# EAGLE design boardV5 (EAGLE 6.4)
Smart Watch

## Sheet 1 of 4: Main CPU
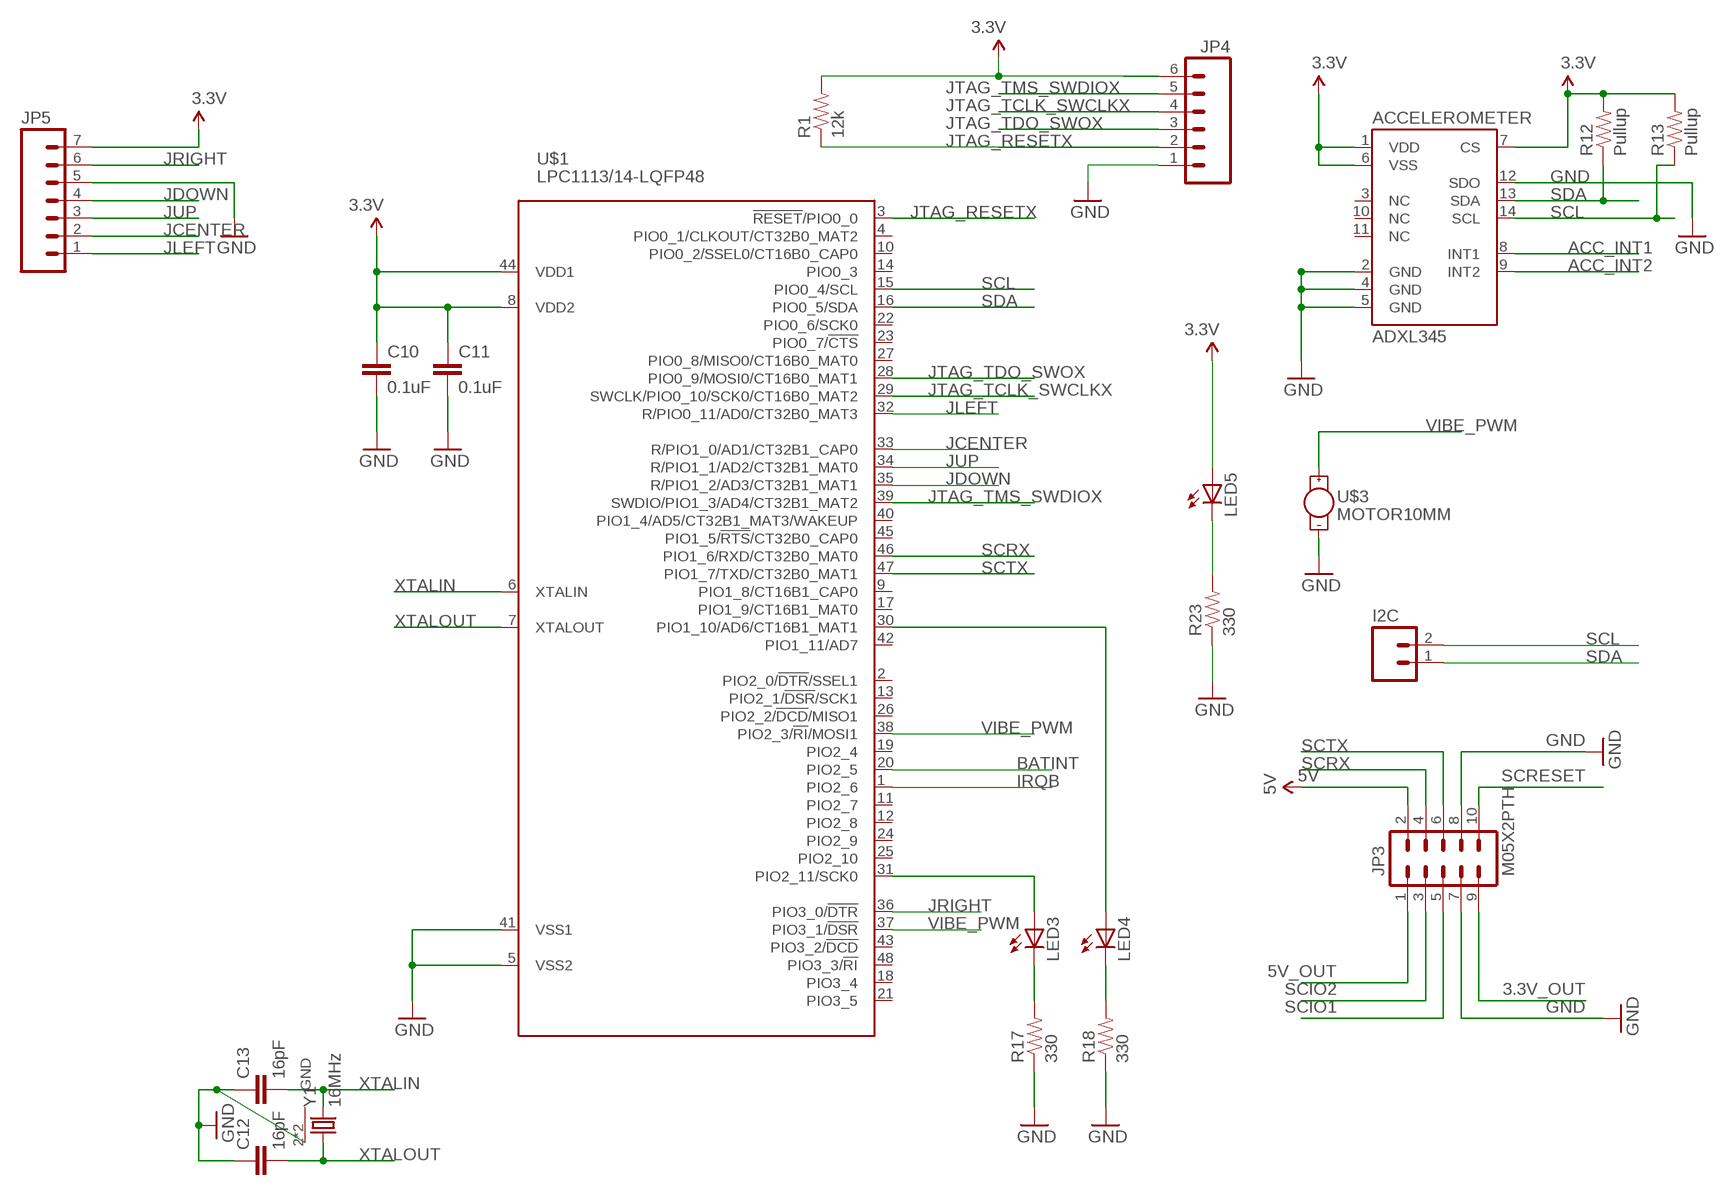
[diagram p0: schematic, sheet 1]

### Parts
ACCELEROMETER  ADXL345  [LGA14]
C10  0.1uF  CAP0603-CAP  [0603-CAP]
C11  0.1uF  CAP0603-CAP  [0603-CAP]
C12  16pF  CAP0603-CAP  [0603-CAP]
C13  16pF  CAP0603-CAP  [0603-CAP]
I2C  M02POLAR  [MOLEX-1X2]
JP3  M05X2PTH  [AVR_ICSP]
JP4  M06POLAR  [MOLEX-1X6]
JP5  M07  [1X07]
LED3  LED0603  [LED-0603]
LED4  LED0603  [LED-0603]
LED5  LED0603  [LED-0603]
R1  12k  RESISTOR0603-RES  [0603-RES]
R12  Pullup  RESISTOR0603-RES  [0603-RES]
R13  Pullup  RESISTOR0603-RES  [0603-RES]
R17  330  RESISTOR0603-RES  [0603-RES]
R18  330  RESISTOR0603-RES  [0603-RES]
R23  330  RESISTOR0603-RES  [0603-RES]
U$1  LPC1113/14-LQFP48  [LQFP48]
U$3  MOTOR10MM  [VIBE-MOTOR-10MM]
Y1  16MHz  CRYSTAL5X3  [CRYSTAL-SMD-5X3]

### Nets
3.3V: ACCELEROMETER.1(VDD) ACCELEROMETER.6(VSS) ACCELEROMETER.7(CS) C10.1 C11.1 JP4.6 JP5.7 LED5.A R1.2 R12.2 R13.2 U$1.8(VDD2) U$1.44(VDD1) ; also sheet 3,4
3.3V_OUT: JP3.9
5V: JP3.2 ; also sheet 4
5V_OUT: JP3.1
ACC_INT1: ACCELEROMETER.8(INT1)
ACC_INT2: ACCELEROMETER.9(INT2)
BATINT: U$1.20(PIO2_5) ; also sheet 4
GND: ACCELEROMETER.2(GND) ACCELEROMETER.4(GND) ACCELEROMETER.5(GND) ACCELEROMETER.12(SDO) C10.2 C11.2 C12.1 C13.1 JP3.7 JP3.8 JP4.1 JP5.5 R17.1 R18.1 R23.1 U$1.5(VSS2) U$1.41(VSS1) U$3.- Y1.2(GND) Y1.4(GND) ; also sheet 3,4
IRQB: U$1.1(PIO2_6) ; also sheet 3
JCENTER: JP5.2 U$1.33(R/PIO1_0/AD1/CT32B1_CAP0)
JDOWN: JP5.4 U$1.35(R/PIO1_2/AD3/CT32B1_MAT1)
JLEFT: JP5.1 U$1.32(R/PIO0_11/AD0/CT32B0_MAT3)
JRIGHT: JP5.6 U$1.36(PIO3_0/!DTR!)
JTAG_RESETX: JP4.2 R1.1 U$1.3(!RESET!/PIO0_0)
JTAG_TCLK_SWCLKX: JP4.4 U$1.29(SWCLK/PIO0_10/SCK0/CT16B0_MAT2)
JTAG_TDO_SWOX: JP4.3 U$1.28(PIO0_9/MOSI0/CT16B0_MAT1)
JTAG_TMS_SWDIOX: JP4.5 U$1.39(SWDIO/PIO1_3/AD4/CT32B1_MAT2)
JUP: JP5.3 U$1.34(R/PIO1_1/AD2/CT32B1_MAT0)
N$15: LED3.A U$1.31(PIO2_11/SCK0)
N$16: LED4.A U$1.30(PIO1_10/AD6/CT16B1_MAT1)
N$17: LED3.C R17.2
N$18: LED4.C R18.2
N$21: LED5.C R23.2
SCIO1: JP3.5
SCIO2: JP3.3
SCL: ACCELEROMETER.14(SCL) I2C.2 R13.1 U$1.15(PIO0_4/SCL) ; also sheet 3,4
SCRESET: JP3.10
SCRX: JP3.4 U$1.46(PIO1_6/RXD/CT32B0_MAT0)
SCTX: JP3.6 U$1.47(PIO1_7/TXD/CT32B0_MAT1)
SDA: ACCELEROMETER.13(SDA) I2C.1 R12.1 U$1.16(PIO0_5/SDA) ; also sheet 3,4
VIBE_PWM: U$1.37(PIO3_1/!DSR!) U$1.38(PIO2_3/!RI!/MOSI1) U$3.+
XTALIN: C13.2 U$1.6(XTALIN) Y1.3
XTALOUT: C12.2 U$1.7(XTALOUT) Y1.1
Unconnected: ACCELEROMETER.3(NC) ACCELEROMETER.10(NC) ACCELEROMETER.11(NC) U$1.2(PIO2_0/!DTR!/SSEL1) U$1.4(PIO0_1/CLKOUT/CT32B0_MAT2) U$1.9(PIO1_8/CT16B1_CAP0) U$1.10(PIO0_2/SSEL0/CT16B0_CAP0) U$1.11(PIO2_7) U$1.12(PIO2_8) U$1.13(PIO2_1/!DSR!/SCK1) U$1.14(PIO0_3) U$1.17(PIO1_9/CT16B1_MAT0) U$1.18(PIO3_4) U$1.19(PIO2_4) U$1.21(PIO3_5) U$1.22(PIO0_6/SCK0) U$1.23(PIO0_7/!CTS!) U$1.24(PIO2_9) U$1.25(PIO2_10) U$1.26(PIO2_2/!DCD!/MISO1) U$1.27(PIO0_8/MISO0/CT16B0_MAT0) U$1.40(PIO1_4/AD5/CT32B1_MAT3/WAKEUP) U$1.42(PIO1_11/AD7) U$1.43(PIO3_2/!DCD!) U$1.45(PIO1_5/!RTS!/CT32B0_CAP0) U$1.48(PIO3_3/!RI!)

## Sheet 2 of 4: Joystick

## Sheet 3 of 4: Bluetooth
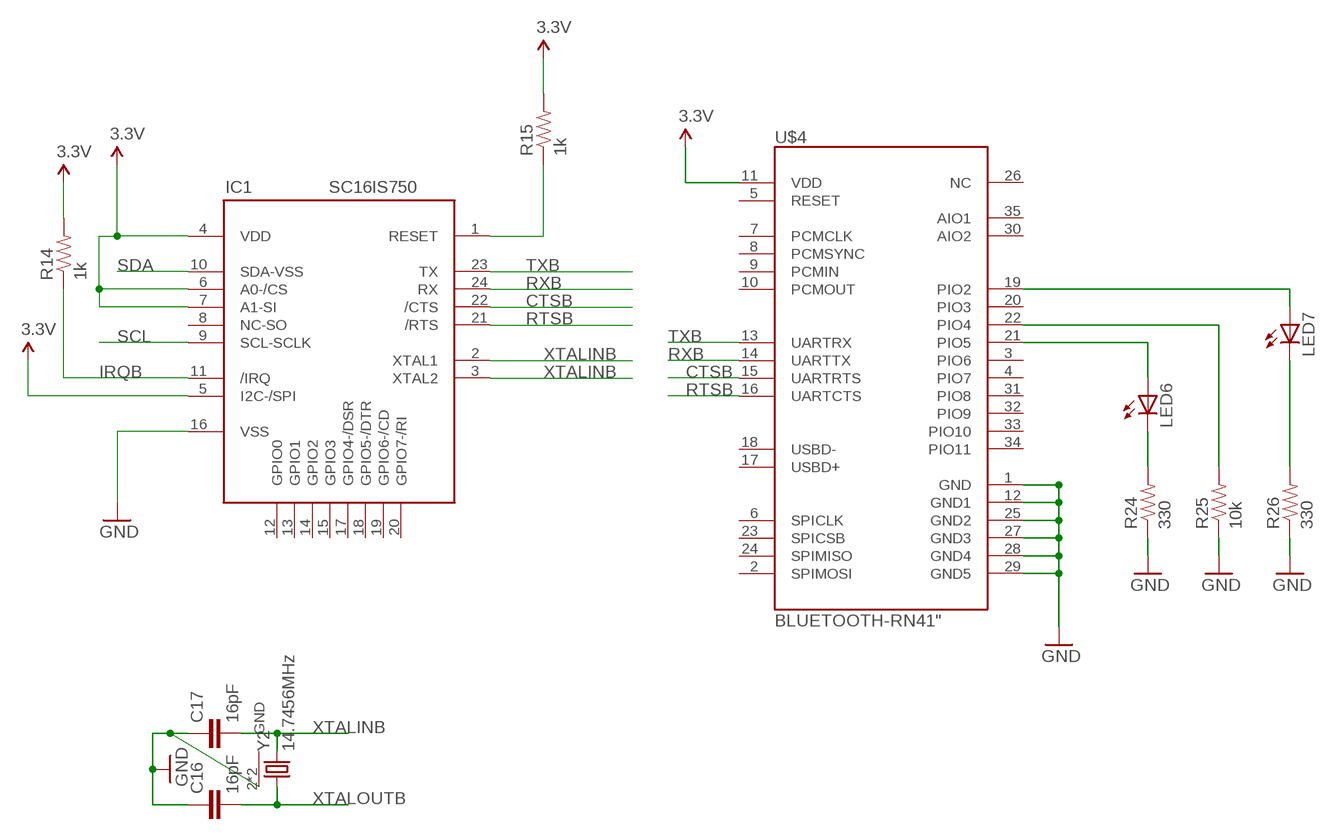
[diagram p1: schematic, sheet 3]

### Parts
C16  16pF  CAP0603-CAP  [0603-CAP]
C17  16pF  CAP0603-CAP  [0603-CAP]
IC1  SC16IS750  [QFN-24]
LED6  LED0603  [LED-0603]
LED7  LED0603  [LED-0603]
R14  1k  RESISTOR0603-RES  [0603-RES]
R15  1k  RESISTOR0603-RES  [0603-RES]
R24  330  RESISTOR0603-RES  [0603-RES]
R25  10k  RESISTOR0603-RES  [0603-RES]
R26  330  RESISTOR0603-RES  [0603-RES]
U$4  BLUETOOTH-RN41"  [RN41]
Y2  14.7456MHz  CRYSTAL5X3  [CRYSTAL-SMD-5X3]

### Nets
3.3V: IC1.4(VDD) IC1.5(I2C-/SPI) IC1.6(A0-/CS) IC1.7(A1-SI) R14.2 R15.2 U$4.11(VDD) ; also sheet 1,4
CTSB: IC1.22(/CTS) U$4.15(UARTRTS)
GND: C16.1 C17.1 IC1.16(VSS) R24.1 R25.1 R26.1 U$4.1(GND) U$4.12(GND1) U$4.25(GND2) U$4.27(GND3) U$4.28(GND4) U$4.29(GND5) Y2.2(GND) Y2.4(GND) ; also sheet 1,4
IRQB: IC1.11(/IRQ) R14.1 ; also sheet 1
N$11: IC1.1(RESET) R15.1
N$20: LED7.A U$4.19(PIO2)
N$22: R25.2 U$4.22(PIO4)
N$23: LED6.A U$4.21(PIO5)
N$24: LED6.C R24.2
N$25: LED7.C R26.2
RTSB: IC1.21(/RTS) U$4.16(UARTCTS)
RXB: IC1.24(RX) U$4.14(UARTTX)
SCL: IC1.9(SCL-SCLK) ; also sheet 1,4
SDA: IC1.10(SDA-VSS) ; also sheet 1,4
TXB: IC1.23(TX) U$4.13(UARTRX)
XTALINB: C17.2 IC1.2(XTAL1) Y2.3
XTALOUTB: C16.2 IC1.3(XTAL2) Y2.1
Unconnected: IC1.8(NC-SO) IC1.12(GPIO0) IC1.13(GPIO1) IC1.14(GPIO2) IC1.15(GPIO3) IC1.17(GPIO4-/DSR) IC1.18(GPIO5-/DTR) IC1.19(GPIO6-/CD) IC1.20(GPIO7-/RI) U$4.2(SPIMOSI) U$4.3(PIO6) U$4.4(PIO7) U$4.5(RESET) U$4.6(SPICLK) U$4.7(PCMCLK) U$4.8(PCMSYNC) U$4.9(PCMIN) U$4.10(PCMOUT) U$4.17(USBD+) U$4.18(USBD-) U$4.20(PIO3) U$4.23(SPICSB) U$4.24(SPIMISO) U$4.26(NC) U$4.30(AIO2) U$4.31(PIO8) U$4.32(PIO9) U$4.33(PIO10) U$4.34(PIO11) U$4.35(AIO1)

## Sheet 4 of 4: Power
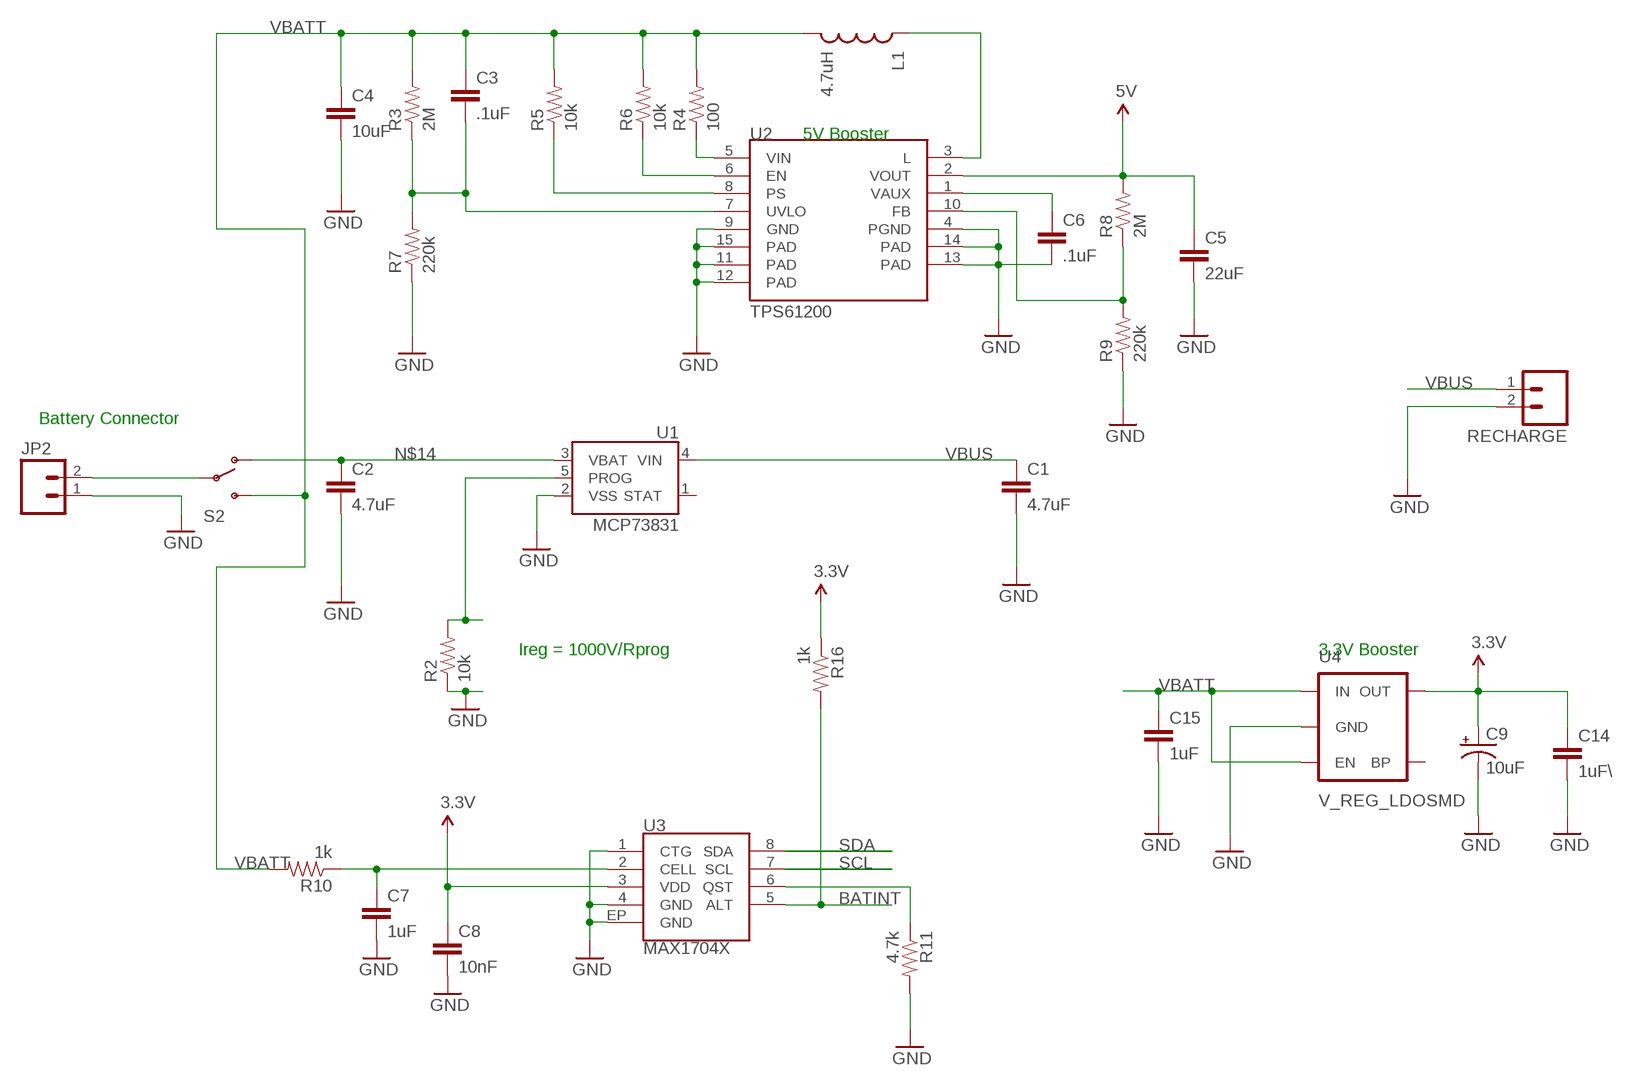
[diagram p2: schematic, sheet 4]

### Parts
C1  4.7uF  CAP0603-CAP  [0603-CAP]
C2  4.7uF  CAP0603-CAP  [0603-CAP]
C3  .1uF  CAP0603-CAP  [0603-CAP]
C4  10uF  CAP0603-CAP  [0603-CAP]
C5  22uF  CAP0603-CAP  [0603-CAP]
C6  .1uF  CAP0603-CAP  [0603-CAP]
C7  1uF  CAP0603-CAP  [0603-CAP]
C8  10nF  CAP0603-CAP  [0603-CAP]
C9  10uF  10UF-TANT  [EIA3216]
C14  1uF\  CAP0603-CAP  [0603-CAP]
C15  1uF  CAP0603-CAP  [0603-CAP]
JP2  M02PTH  [1X02]
L1  4.7uH  INDUCTOR.  [CDRH2D09]
R2  10k  RESISTOR0603-RES  [0603-RES]
R3  2M  RESISTOR0603-RES  [0603-RES]
R4  100  RESISTOR0603-RES  [0603-RES]
R5  10k  RESISTOR0603-RES  [0603-RES]
R6  10k  RESISTOR0603-RES  [0603-RES]
R7  220k  RESISTOR0603-RES  [0603-RES]
R8  2M  RESISTOR0603-RES  [0603-RES]
R9  220k  RESISTOR0603-RES  [0603-RES]
R10  1k  RESISTOR0603-RES  [0603-RES]
R11  4.7k  RESISTOR0603-RES  [0603-RES]
R16  1k  RESISTOR0603-RES  [0603-RES]
RECHARGE  M02POLAR  [MOLEX-1X2]
S2  SWITCH-SPDT-SMD-A  [SWITCH-SPST-SMD-A]
U1  MCP73831  [SOT23-5]
U2  TPS61200  [QFN-10_PAD]
U3  MAX1704X  [TDFN-8]
U4  V_REG_LDOSMD  [SOT23-5]

### Nets
3.3V: C8.1 C9.A(+) C14.1 R16.1 U3.3(VDD) U4.5(OUT) ; also sheet 1,3
5V: C5.1 R8.2 U2.2(VOUT) ; also sheet 1
BATINT: R16.2 U3.5(ALT) ; also sheet 1
GND: C1.2 C2.2 C4.2 C5.2 C6.2 C7.2 C8.2 C9.C(-) C14.2 C15.2 JP2.1 R2.1 R7.1 R9.1 R11.2 RECHARGE.2 U1.2(VSS) U2.4(PGND) U2.9(GND) U2.11(PAD) U2.12(PAD) U2.13(PAD) U2.14(PAD) U2.15(PAD) U3.1(CTG) U3.4(GND) U3.EP(GND) U4.2(GND) ; also sheet 1,3
N$2: R2.2 U1.5(PROG)
N$3: C3.2 R3.1 R7.2 U2.7(UVLO)
N$4: C6.1 U2.1(VAUX)
N$5: R6.1 U2.6(EN)
N$6: R5.1 U2.8(PS)
N$7: L1.P$1 U2.3(L)
N$8: R8.1 R9.2 U2.10(FB)
N$9: C7.1 R10.1 U3.2(CELL)
N$10: R11.1 U3.6(QST)
N$14: C2.1 S2.1(O) U1.3(VBAT)
N$26: JP2.2 S2.2(P)
SCL: U3.7(SCL) ; also sheet 1,3
SDA: U3.8(SDA) ; also sheet 1,3
VBATT: C3.1 C4.1 C15.1 L1.P$2 R3.2 R4.2 R5.2 R6.2 R10.2 S2.3(S) U4.1(IN) U4.3(EN)
VBUS: C1.1 RECHARGE.1 U1.4(VIN)
VIN: R4.1 U2.5(VIN)
Unconnected: U1.1(STAT) U4.4(BP)

### Notes on the sheet
- 5V Booster
- Battery Connector
- Ireg = 1000V/Rprog | 3.3V Booster

## Library data of the parts
ACCELEROMETER = SparkFun-Sensors:ADXL345: 3-axis SPI/I2C 2/4/8/16g accelerometer
C1-C8 C10-C17 = SparkFun-Passives:CAP: Capacitor Standard 0603 ceramic capacitor, and 0.1" leaded capacitor.
C9 = SparkFun-Capacitors:10UF-TANT: 10uF Tantalum SMT CAP-00811- 16V 10% (EIA-3216); PROD_ID: CAP-00811
I2C JP2 RECHARGE = SparkFun-Connectors:M02: Header 2 Standard 2-pin 0.1" header. Use with straight break away headers (SKU : PRT-00116), right angle break away headers (PRT-00553), swiss pins (PRT-00743), machine pins (PRT-00117), and female headers (PRT-00115). Molex polarized connector foot print use with SKU : PRT-08233 with associated crimp pins and housings.
IC1 = SparkFun-DigitalIC:SC16IS750: SPI/I2C/IrDA to UART
JP3 = SparkFun-Connectors:M05X2: Header 5x2 Standard 10-pin dual row 0.1" header. Commonly used with AVR-ISP. Use with Spark Fun Electronics SKU: PRT-00778
JP4 = SparkFun-Connectors:M06: Header 6 Standard 6-pin 0.1" header. Use with straight break away headers (SKU : PRT-00116), right angle break away headers (PRT-00553), swiss pins (PRT-00743), machine pins (PRT-00117), and female headers (PRT-00115). Molex polarized connector foot print use with SKU : PRT-08094 with associated crimp pins and housings. NOTES ON THE VARIANTS LOCK and LOCK_LONGPADS... This footprint was designed to help hold the alignment of a through-hole component (i.e. 6-pin header) while soldering it into place. You may notice that each hole has been shifted either up or down by 0.005 of an inch from it's more standard position (which is a perfectly straight line). This slight alteration caused the pins (the squares in the middle) to touch the edges of the holes. Because they are alternating, it causes a "brace" to hold the component in place. 0.005 has proven to be the perfect amount of "off-center" position when using our standard breakaway headers. Although looks a little odd when you look at the bare footprint, once you have a header in there, the alteration is very hard to notice. Also, if you push a header all the way into place, it is covered up entirely on the bottom side. This idea of altering the position of holes to aid alignment will be further integrated into the Sparkfun Library for other footprints. It can help hold any component with 3 or more connection pins.
JP5 = SparkFun-Connectors:M07: Header 7 Standard 7-pin 0.1" header. Use with straight break away headers (SKU : PRT-00116), right angle break away headers (PRT-00553), swiss pins (PRT-00743), machine pins (PRT-00117), and female headers (PRT-00115). NOTES ON THE VARIANTS LOCK and LOCK_LONGPADS... This footprint was designed to help hold the alignment of a through-hole component (i.e. 7-pin header) while soldering it into place. You may notice that each hole has been shifted either up or down by 0.005 of an inch from it's more standard position (which is usually a perfectly straight line). This slight alteration caused the pins (the squares in the middle) to touch the edges of the holes. Because they are alternating, it causes a "brace" to hold the header in place. 0.005 has proven to be the perfect amount of "off-center" position when using our standard breakaway headers. Although looks a little odd when you look at the bare footprint, once you have a header in there, the alteration is very hard to notice. Also, if you push a header all the way into place, it is covered up entirely on the bottom side. This idea of altering the position of holes to aid alignment will be further integrated into the Sparkfun Library for other footprints. It can help hold any component with 3 or more connection pins.
L1 = SparkFun-Passives:INDUCTOR: Inductors Basic Inductor/Choke - 0603 and 1206. Footprints are not proven and vary greatly between part numbers.
LED3-LED7 = SparkFun-LED:LED: LEDs Standard schematic elements and footprints for 5mm, 3mm, 1206, and 0603 sized LEDs. 5mm - Spark Fun Electronics SKU : COM-00529 (and others)
R1-R7 R10 R11 R14-R18 R23-R26 = SparkFun-Passives:RESISTOR: Resistor Basic schematic elements and footprints for 0603, 1206, and PTH resistors.
R8 R9 R12 R13 = SparkFun-Resistors:RESISTOR: Resistor Basic schematic elements and footprints for 0603, 1206, and PTH resistors.
S2 = SparkFun-Electromechanical:SWITCH-SPDT: SPDT Switch Simple slide switch, Spark Fun Electronics SKU : COM-00102 DPDT SMT slide switch, AYZ0202, SWCH-08179
U1 = SparkFun-PowerIC:MCP73831: Miniature single cell, fully integrated Li-Ion, Li-polymer charge management controller http://ww1.microchip.com/downloads/en/DeviceDoc/21984a.pdf IC-09995; PROD_ID: IC-09995
U2 = SparkFun-PowerIC:TPS61200: DC to DC Booster IC-10035; PROD_ID: IC-10035
U3 = SparkFun-PowerIC:MAX1704X: MAX17043/MAX17044: Battery Fuel Guage (43 is 1cell, 44 is 2cell)
U4 = SparkFun-PowerIC:V_REG_LDO: Voltage Regulator LDO Standard 150mA LDO voltage regulator in SOT-23 layout. Micrel part MIC5205. BP (by-pass) pin is used to lower output noise with 470pF cap.
U$1 = lpc1100v1.1:LPC1113/14-LQFP48: NXP Semiconductors LPC11xx microcontrollers <http://ics.nxp.com/products/lpc1000/lpc11xx/> ARM 32-bit Cortex-M0 Microcontroller with MPU CPU clock up to 50MHz Up to 32KByte on-chip Flash ROM with In-System Programming (ISP) and In-Application Programming (IAP) via On-Chip Bootloader Up to 8KByte SRAM Nested Vectored Interrupt Controller Up to 2 SPI controllers UART with full Modem Interface and RS485 Support Fast Mode I2C-Bus 4 Timers with 4 capture channels and 13 output channels Watchdog (WDT) Sytem tick timer 10-bit ADC with 8 channels Power Management Unit (PMU) Brownout detection 12MHz internal RC oscillator Serial Wire Debug/Trace port
U$3 = SparkFun-Electromechanical:MOTOR: Vibration Motor- ROB-08449 Physical dimension and wire connections for this powerful vibration motor. Motor has a self adhesive backing.
U$4 = SparkFun-RF:BLUETOOTH-RN41: Bluetooth SMD module
Y1 Y2 = SparkFun-FreqCtrl:CRYSTAL: Various standard crystals. Proven footprints. Spark Fun Electronics SKU : COM-00534

## Board
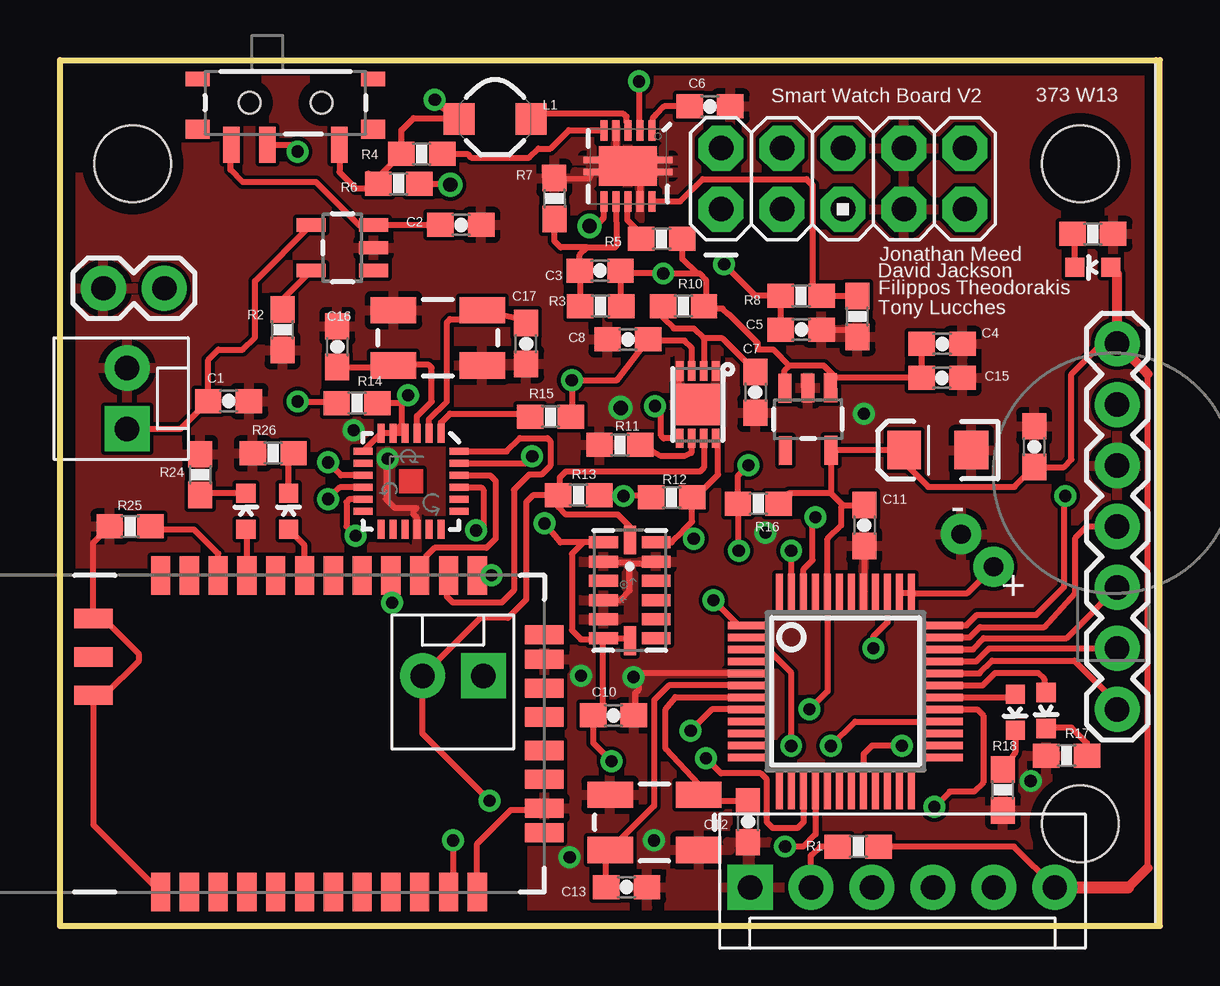
[diagram p3: board, top side]
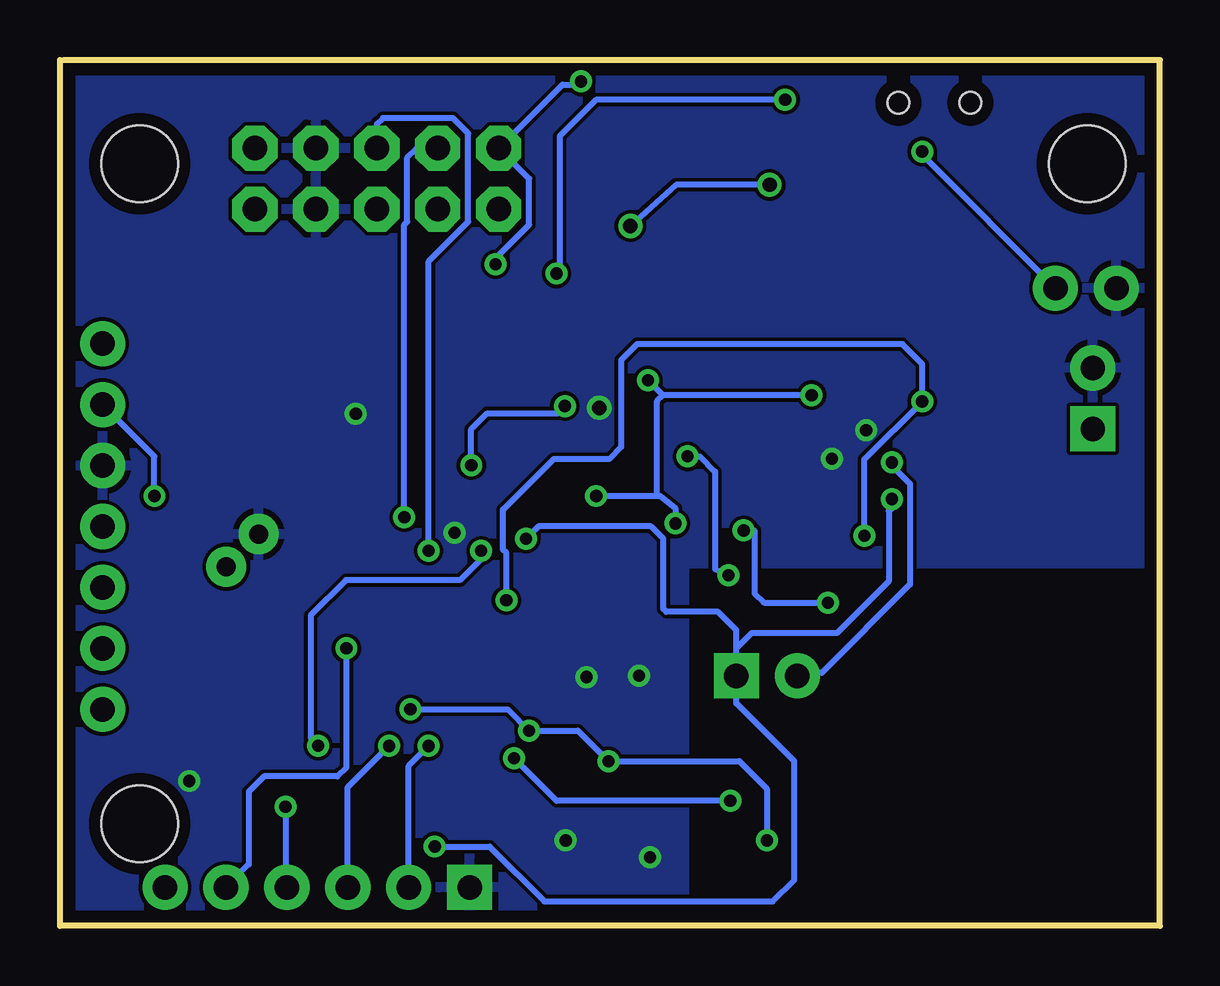
[diagram p4: board, bottom side, seen from below]

Size 45.85 x 36.07 mm. Coordinates in mm from the lower left corner, seen from the top.
Outline: 45.69,36.07 0,36.07 0,0 45.85,0 45.85,36.07
Copper layers (1*16): Top 0.0178mm / dielectric 59mil / Bottom 0.0178mm
Design rules "default *": minimum track width 6mil, minimum drill 14mil, track to track 6mil, track to pad 6mil, pad to pad 6mil, via to via 6mil, smd to smd 6mil, copper to edge 20mil, drill to drill 16mil, minimum pad ring 8mil, minimum via ring 8mil, stop-mask expansion 3mil, vias tented up to drill 0mil, thermal gap 10mil
Holes 3.2 mm at 42.53,31.75 3.03,31.75 42.53,4.25

### Footprints (pad centres in the part's own frame; a part is rotated, then mirrored left to right if it is on the bottom)
LGA14 = smd 0.5 x 1.2: 1 2,1.1; 2 1.2,1.1; 3 0.4,1.1; 4 -0.4,1.1; 5 -1.2,1.1; 6 -2,1.1; 8 -2,-1.1; 9 -1.2,-1.1; 10 -0.4,-1.1; 11 0.4,-1.1; 12 1.2,-1.1; 13 2,-1.1 | smd 1.2 x 0.5: 7 -2.1,0; 14 2.1,0
0603-CAP = smd 1.1 x 1: 1 -0.85,0; 2 0.85,0
EIA3216 = smd 1.4 x 1.6: A 1.4,0; C -1.4,0
MOLEX-1X2 = drill 1.016 pad 1.88 square: 1 0,0 | drill 1.016 pad 1.88: 2 2.54,0
QFN-24 = smd 0.8 x 0.3: 1 -2,1.25; 2 -2,0.75; 3 -2,0.25; 4 -2,-0.25; 5 -2,-0.75; 6 -2,-1.25; 13 2,-1.25; 14 2,-0.75; 15 2,-0.25; 16 2,0.25; 17 2,0.75; 18 2,1.25 | smd 0.3 x 0.8: 7 -1.25,-2; 8 -0.75,-2; 9 -0.25,-2; 10 0.25,-2; 11 0.75,-2; 12 1.25,-2; 19 1.25,2; 20 0.75,2; 21 0.25,2; 22 -0.25,2; 23 -0.75,2; 24 -1.25,2
1X02 = drill 1.016 pad 1.88: 1 0,0; 2 2.54,0
AVR_ICSP = drill 1.016 pad 1.88 octagon: 1 -1.27,5.08; 2 1.27,5.08; 3 -1.27,2.54; 4 1.27,2.54; 5 -1.27,0; 6 1.27,0; 7 -1.27,-2.54; 8 1.27,-2.54; 9 -1.27,-5.08; 10 1.27,-5.08
MOLEX-1X6 = drill 1.016 pad 1.88 square: 1 0,0 | drill 1.016 pad 1.88: 2 2.54,0; 3 5.08,0; 4 7.62,0; 5 10.16,0; 6 12.7,0
1X07 = drill 1.016 pad 1.88: 1 0,0; 2 2.54,0; 3 5.08,0; 4 7.62,0; 5 10.16,0; 6 12.7,0; 7 15.24,0
CDRH2D09 = smd 1.3 x 1.3: P$1 -1.5,0; P$2 1.5,0
LED-0603 = smd 0.8 x 0.8: A 0,-0.75; C 0,0.75
0603-RES = smd 1.1 x 1: 1 -0.85,0; 2 0.85,0
SWITCH-SPST-SMD-A = smd 0.7 x 1.5: 1 -2.25,-1.75; 2 -0.75,-1.75; 3 2.25,-1.75 | smd 1 x 0.6: GND1 -3.65,1; GND3 3.65,1 | smd 1 x 0.8: GND2 -3.65,-1.1; GND4 3.65,-1.1 | hole 0.9: -1.5,0; 1.5,0
SOT23-5 = smd 0.55 x 1.2: 1 -0.95,-1.3; 2 0,-1.3; 3 0.95,-1.3; 4 0.95,1.3; 5 -0.95,1.3
QFN-10_PAD = smd 0.297 x 0.85: 1 -1,-1.475; 2 -0.5,-1.475; 3 0,-1.475; 4 0.5,-1.475; 5 1,-1.475; 6 1,1.475; 7 0.5,1.475; 8 0,1.475; 9 -0.5,1.475; 10 -1,1.475 | smd 0.7 x 0.28: 11 -1.5,0.25; 12 -1.5,-0.25; 13 1.5,0.25; 14 1.5,-0.25 | smd 2.4 x 1.65: 15 0,0
TDFN-8 = smd 0.8 x 0.3: 1 -1.4,0.75; 2 -1.4,0.25; 3 -1.4,-0.25; 4 -1.4,-0.75; 5 1.4,-0.75; 6 1.4,-0.25; 7 1.4,0.25; 8 1.4,0.75 | smd 1.73 x 1.88: EP 0,0
LQFP48 = smd 0.3 x 1.6: 1 -2.75,-4.1; 2 -2.25,-4.1; 3 -1.75,-4.1; 4 -1.25,-4.1; 5 -0.75,-4.1; 6 -0.25,-4.1; 7 0.25,-4.1; 8 0.75,-4.1; 9 1.25,-4.1; 10 1.75,-4.1; 11 2.25,-4.1; 12 2.75,-4.1; 25 2.75,4.1; 26 2.25,4.1; 27 1.75,4.1; 28 1.25,4.1; 29 0.75,4.1; 30 0.25,4.1; 31 -0.25,4.1; 32 -0.75,4.1; 33 -1.25,4.1; 34 -1.75,4.1; 35 -2.25,4.1; 36 -2.75,4.1 | smd 1.6 x 0.3: 13 4.1,-2.75; 14 4.1,-2.25; 15 4.1,-1.75; 16 4.1,-1.25; 17 4.1,-0.75; 18 4.1,-0.25; 19 4.1,0.25; 20 4.1,0.75; 21 4.1,1.25; 22 4.1,1.75; 23 4.1,2.25; 24 4.1,2.75; 37 -4.1,2.75; 38 -4.1,2.25; 39 -4.1,1.75; 40 -4.1,1.25; 41 -4.1,0.75; 42 -4.1,0.25; 43 -4.1,-0.25; 44 -4.1,-0.75; 45 -4.1,-1.25; 46 -4.1,-1.75; 47 -4.1,-2.25; 48 -4.1,-2.75
VIBE-MOTOR-10MM = drill 0.8 pad 1.676: + -5,-3.9; - -6.35,-2.54
RN41 = smd 0.8 x 1.6: 1 -6.6,-6.6; 2 -5.4,-6.6; 3 -4.2,-6.6; 4 -3,-6.6; 5 -1.8,-6.6; 6 -0.6,-6.6; 7 0.6,-6.6; 8 1.8,-6.6; 9 3,-6.6; 10 4.2,-6.6; 11 5.4,-6.6; 12 6.6,-6.6; 13 6.6,6.6; 14 5.4,6.6; 15 4.2,6.6; 16 3,6.6; 17 1.8,6.6; 18 0.6,6.6; 19 -0.6,6.6; 20 -1.8,6.6; 21 -3,6.6; 22 -4.2,6.6; 23 -5.4,6.6; 24 -6.6,6.6 | smd 1.6 x 0.8: 25 -9.4,4.8; 26 -9.4,3.2; 27 -9.4,1.6; 28 9.4,3.1; 29 9.4,-3.1; 30 9.4,-4.122; 31 9.4,-1.9; 32 9.4,-0.7; 33 9.4,0.7; 34 9.4,1.9; 35 9.4,4.122
CRYSTAL-SMD-5X3 = smd 1.9 x 1.1: 1 -1.85,-1.15; 2 1.85,-1.15; 3 1.85,1.15; 4 -1.85,1.15

### Placement (x,y rotation side)
ACCELEROMETER  23.75,13.97 90 top
C1  7.03,21.86 0 top
C2  16.71,29.2 0 top
C3  22.51,27.3 180 top
C4  36.77,24.24 0 top
C5  30.9,24.84 0 top
C6  27.1,34.14 0 top
C7  28.99,22.23 270 top
C8  23.67,24.43 180 top
C9  36.59,19.82 180 top
C10  23.07,8.76 0 top
C11  33.53,16.68 270 top
C12  28.68,4.33 90 top
C13  23.62,1.61 180 top
C14  40.61,19.97 90 top
C15  36.77,22.83 0 top
C16  11.56,24.13 270 top
C17  19.43,24.26 90 top
I2C  17.65,10.41 180 top
IC1  14.63,18.52 270 top
JP2  1.81,26.56 0 top
JP3  32.64,31.13 90 top
JP4  28.77,1.6 0 top
JP5  44.07,9.02 90 top
L1  18.14,33.62 180 top
LED3  41.1,8.97 180 top
LED4  39.82,8.9 180 top
LED5  43.05,27.43 90 top
LED6  7.75,17.27 0 top
LED7  9.53,17.27 0 top
R1  33.27,3.3 0 top
R2  9.28,24.84 90 top
R3  22.54,25.82 0 top
R4  15.08,32.16 180 top
R5  25.08,28.62 0 top
R6  14.12,30.92 180 top
R7  20.61,30.3 270.3 top
R8  30.89,26.25 180 top
R9  33.24,25.39 90 top
R10  25.99,25.82 0 top
R11  23.34,20.03 180 top
R12  25.5,17.85 180 top
R13  21.62,17.93 0 top
R14  12.38,21.78 0 top
R15  20.45,21.21 0 top
R16  29.11,17.59 180 top
R17  41.96,7.09 0 top
R18  39.3,5.66 90 top
R23  43.05,28.83 180 top
R24  5.84,18.8 270 top
R25  2.92,16.64 0 top
R26  8.89,19.68 0 top
RECHARGE  2.79,20.7 90 top
S2  9.4,34.29 0 top
U1  11.77,28.25 90 top
U2  23.68,31.65 180 top
U3  26.59,21.71 270 top
U4  31.18,21.11 180.4 top
U$1  32.74,9.76 270 top
U$3  43.92,18.86 0 top
U$4  10.79,8 0 top
Y1  24.78,4.31 180 top
Y2  15.75,24.5 0 top

### Tracks (layer width: path | path; a pad name or v marks a point on that pad's centre or on a via)
3.3V  (via drill 0.51)
  Top 0.254: 43.81,27.42 LED5.A | U$1.8 27.18,9.01 v26.29,8.13 | v16.38,3.56 16.38,1.59 U$4.11 | 22.96,6.88 v22.99,6.86 22.22,7.62 C10.1 22.62,9.16 22.62,11.94 | v31.24,9.02 31.99,9.77 U$1.44 31.99,16.11 32.56,16.69 32.56,17.44 32.64,17.51 | R15.2 21.34,21.55 v21.34,22.73 23.22,22.73 C8.1 | 22.62,11.94 21.72,11.94 21.34,12.32 21.34,15.49 21.81,15.97 ACCELEROMETER.1 20.86,15.97 v20.19,16.76 | 22.62,11.94 ACCELEROMETER.6 23.65,11.97 ACCELEROMETER.7 | C8.1 24.78,24.2 | C9.A U4.5 32.14,18.02 | 14.24,21.78 v14.52,22.11 | 32.64,17.51 33.51,17.51 C11.1 | C9.A 35.19,19.68 | IC1.4 IC1.5 | 14.24,21.78 R14.2 | R13.2 23.51,17.93 | 23.51,17.93 24.56,17.93 R12.2 | U3.3 26.34,24.08 26.04,24.38 24.57,24.38 C8.1 | 14.24,21.78 14.24,20.87 IC1.5 | 32.14,18.02 32.64,17.51 | C9.A 35.19,19.29 36.2,18.29 39.79,18.29 C14.1 41.85,19.11 42.16,19.43 42.16,22.99 43.31,24.13 43.94,24.13 JP5.7 | JP4.6 39.77,3.3 R1.2 | 23.51,17.93 v23.5,17.91 | 45.31,23.01 45.31,2.39 45.17,2.25 | 32.14,18.02 30.38,18.02 R16.1 | IC1.5 IC1.6 IC1.7
  Top 0.406: 44.53,1.6 45.17,2.25 45.34,2.41 | 45.34,22.99 45.31,23.01 JP5.7 44.07,27.17 LED5.A
  Top 0.508: JP4.6 44.53,1.6
  Bottom 0.254: v31.24,9.02 27.18,9.02 v26.29,8.13 24.26,8.13 v22.99,6.86 17.53,6.86 16.38,5.71 v16.38,3.56 | v14.52,22.11 20.71,22.11 | 20.71,22.11 v21.34,22.73 | v23.5,17.91 20.95,17.91 | 20.95,17.91 20.95,21.87 20.71,22.11 | 20.95,17.91 20.83,17.91 20.19,17.4 v20.19,16.76
5V  (via drill 0.51)
  Top 0.254: C5.1 R8.2 29,26.25 v27.69,27.56 | v24.13,35.18 24.13,33.17 U2.2
  Bottom 0.254: v24.13,35.18 24.26,35.05 24.89,35.05 27.54,32.4 JP3.2 26.29,31.13 26.29,29.21 27.69,27.81 v27.69,27.56
BATINT  (via drill 0.51)
  Top 0.254: v28.7,19.19 28.26,18.75 R16.2 28.26,15.66 v28.3,15.62 | 24.8,21.34 v24.8,21.65 25.06,21.4 25.06,20.42 25.17,20.31 U3.5 | v35.09,7.51 33.85,7.51 33.49,7.15 U$1.20 | U$1.20
  Bottom 0.254: v28.7,19.19 28.7,20.69 28.04,21.35 25.11,21.35 v24.8,21.65 | v28.3,15.62 28.3,15.28 29.17,14.4 33.92,14.4 35.4,12.93 35.4,7.81 v35.09,7.51
CTSB
  Top 0.254: IC1.22 17.94,18.77 18.16,18.54 18.16,16.13 17.78,15.75 15.62,15.75 15.24,15.37 15.24,14.85 U$4.15
GND  (via drill 0.51, 0.6)
  Top 0.254: R25.1 1.4,15.96 U$4.25 1.5,12.7 1.91,12.7 3.3,11.3 3.3,11.05 1.85,9.6 U$4.27 1.4,4.2 U$4.1 | U$4.12 17.39,3.42 18.8,4.83 20.12,4.83 U$4.29 | 20.27,11.18 U$4.28 | ACCELEROMETER.4 23.35,13.57 23.75,13.97 23.75,15.11 | ACCELEROMETER.2 22.72,15.24 23.13,15.24 23.23,15.14 23.72,15.14 23.75,15.11 | R7.1 22.06,31.13 U2.13 22.85,31.39 23.11,31.65 U2.15 | C5.2 32.94,24.84 R9.1 | C11.2 33.53,13.9 U$1.41 | U$1.5 24.27,10.51 24.11,10.35 24.11,9.82 23.98,9.69 23.98,8.82 C10.2 | U2.4 23.18,32.15 U2.15 | U2.15 23.68,31.56 24.18,31.05 U2.9 | U2.15 24.14,31.65 24.38,31.9 U2.12 | U3.4 25.71,21.98 U3.EP | 13.59,19.43 13.59,17.78 13.97,17.4 14.86,17.4 14.73,17.27 14.73,17.14 14.86,17.02 14.86,16.54 IC1.16 | ACCELEROMETER.12 24.37,15.17 24.27,15.07 23.79,15.07 23.75,15.11
  other vias: 21.72,10.41 24.77,3.56 40.46,6.03 33.52,21.34 23.37,21.58 21.25,2.86 23.9,10.36 29.4,16.37 13.67,19.46 12.24,20.65
  pour Top: 0.38,15.11 19.68,15.11 19.68,0.51 45.47,0.51 45.47,35.69 0.38,35.69 0.38,35.31
  pour Bottom: 0.25,35.81 45.59,35.81 45.59,0.25 19.81,0.25 19.81,15.11 0.25,15.11 0.25,35.18
IRQB  (via drill 0.51)
  Top 0.254: IC1.11 12.05,17.77 11.94,17.65 11.94,16.64 v12.32,16.26 | v9.91,21.84 11.47,21.84 R14.1 | U$1.1 28.29,12.51 v27.24,13.56
  Bottom 0.254: v12.32,16.26 12.32,19.43 v9.91,21.84 9.91,23.41 10.73,24.23 21.79,24.23 22.45,23.57 22.45,19.94 22.95,19.44 25.27,19.44 27.38,17.34 27.38,15.67 27.24,15.53 v27.24,13.56
JCENTER
  Top 0.254: U$1.33 38.19,11.01 38.73,11.56 JP5.2
JDOWN
  Top 0.254: U$1.35 37.92,12.01 38.35,12.45 41.02,12.45 42.33,13.87 42.33,16.17 42.8,16.64 JP5.4
JLEFT
  Top 0.254: U$1.32 38.33,10.51 38.86,11.05 42.29,11.05 44.07,9.27 JP5.1
JRIGHT  (via drill 0.51)
  Top 0.254: U$1.36 37.79,12.51 38.23,12.95 40.69,12.95 41.86,14.12 41.86,17.86 v41.91,17.91
  Bottom 0.254: v41.91,17.91 41.91,19.56 JP5.6
JTAG_RESETX  (via drill 0.51)
  Top 0.254: JP4.2 31.31,2.92 | 31.31,2.92 31.31,2.95 | v30.48,7.49 30.48,10.54 29.51,11.51 U$1.3 | R1.1 31.69,3.3 31.31,2.92
  Bottom 0.254: JP4.2 31.31,6.66 v30.48,7.49
JTAG_TCLK_SWCLKX  (via drill 0.51)
  Top 0.254: U$1.29 38.23,9.01 38.48,8.76 38.48,5.97 38.1,5.59 37.08,5.59 v36.45,4.95
  Bottom 0.254: v36.45,4.95 36.45,1.66 JP4.4
JTAG_TDO_SWOX  (via drill 0.51)
  Top 0.254: v32.13,7.49 33.15,8.51 U$1.28
  Bottom 0.254: JP4.3 33.85,5.78 v32.13,7.49
JTAG_TMS_SWDIOX  (via drill 0.51)
  Top 0.254: v33.91,11.56 33.91,12.06 34.49,12.65 U$1.39
  Bottom 0.254: v33.91,11.56 33.91,6.6 34.29,6.22 37.34,6.22 37.97,5.59 37.97,2.56 JP4.5
JUP
  Top 0.254: U$1.34 38.06,11.51 38.49,11.99 41.96,11.99 JP5.3
N$2
  Top 0.254: R2.2 9.28,26.11 U1.5
N$3
  Top 0.254: R3.1 21.69,27.27 C3.2 21.66,27.95 21.98,28.27 | 21.98,28.27 23.13,28.27 23.22,28.36 23.22,29.04 U2.7 | 21.98,28.27 20.87,28.27 20.61,28.52 R7.2
N$4
  Top 0.254: C6.1 25.18,34.14 24.84,33.8 24.84,33.78 24.7,33.64 24.7,33.15 U2.1
N$5  (via drill 0.6)
  Top 0.254: R6.1 16.22,30.92 v16.27,30.87 | v22.07,29.16 22.34,29.16 22.61,29.43 22.61,29.44 22.67,29.5 U2.6
  Bottom 0.254: v16.27,30.87 20.17,30.87 v22.07,29.16
N$6
  Top 0.254: R5.1 24.23,28.82 23.65,29.4 23.65,30.15 U2.8
N$7
  Top 0.254: U2.3 23.69,33.4 23.62,33.47 23.62,33.72 23.48,33.83 19.88,33.83 L1.P$1 19.66,33.64
N$8
  Top 0.254: R9.2 R8.1 31.37,26.62 31.37,30.86 31.11,31.11 26.8,31.11 25.86,30.18 U2.10
N$9
  Top 0.254: R10.1 25.14,25.34 25.59,24.89 26.42,24.89 26.84,24.47 | 26.84,24.47 U3.2 | U3.2 | C7.1 28.99,23.11 27.62,24.47 26.84,24.47
N$10
  Top 0.254: U3.6 26.32,19.71 26.02,19.57 25.06,19.57 R11.1
N$11
  Top 0.254: IC1.1 15.88,20.96 16.26,21.34 19.47,21.34 R15.1
N$14
  Top 0.254: C2.1 14.55,29.2 U1.3 12.46,29.2 10.67,30.99 7.62,30.99 7.11,31.5 7.11,32.5 S2.1
N$15
  Top 0.254: U$1.31 38.46,10.01 38.99,10.54 40.77,10.54 41.02,10.29 41.02,9.8 LED3.A
N$16
  Top 0.254: U$1.30 39.68,9.51 LED4.A
N$17
  Top 0.254: 41.19,8.22 LED3.C 41.14,8.26 42.16,8.26 42.81,7.61 R17.2
N$18
  Top 0.254: LED4.C 39.82,7.22 R18.2
N$20
  Top 0.254: U$4.19 10.2,15.85 LED7.A
N$21
  Top 0.254: LED5.C 42.3,28.73 R23.2
N$22
  Top 0.254: U$4.22 6.59,15.5 5.59,16.51 3.9,16.51 R25.2
N$23
  Top 0.254: U$4.21 7.79,16.47 LED6.A
N$24
  Top 0.254: LED6.C 5.92,18.02 R24.2
N$25
  Top 0.254: LED7.C 9.53,19.47 R26.2
N$26  (via drill 0.51)
  Top 0.254: S2.2 9.62,32.54 v9.91,32.26
  Bottom 0.254: v9.91,32.26 9.91,32.12 JP2.2
RTSB  (via drill 0.51)
  Top 0.254: v13.84,13.46 13.84,14.55 U$4.16 | IC1.21 17.55,18.27 17.65,18.16 17.65,16.6 v17.35,16.47
  Bottom 0.254: v13.84,13.46 16.51,13.46 16.89,13.84 16.9,16.47 v17.35,16.47
RXB
  Top 0.254: IC1.24 18.62,19.77 19.18,20.32 20.32,20.32 20.45,20.19 20.45,19.18 20.07,18.8 19.56,18.8 18.92,18.16 18.92,13.97 18.41,13.46 16.38,13.46 16.13,13.72 16.13,14.54 U$4.14
SCL  (via drill 0.51)
  Top 0.254: R13.1 20.77,17.45 21.08,17.14 23.24,17.14 23.75,16.64 ACCELEROMETER.14 | U3.7 26.84,19.09 26.67,18.92 21.08,18.92 20.83,18.67 20.83,17.99 R13.1 | U$1.15 30.99,4.32 30.73,4.06 29.72,4.06 29.46,4.32 29.46,6.1 29.21,6.35 27.56,6.35 v26.92,6.99 | v17.91,5.21 15.11,8 I2C.2 17.53,12.83 18.67,12.83 19.43,13.59 19.43,17.65 19.71,17.93 R13.1 | IC1.9 11.71,18.77 v11.18,19.3
  Bottom 0.254: v17.91,5.21 25.15,5.21 v26.92,6.99 | v11.18,19.3 11.18,19.18 10.41,18.41 10.41,14.22 14.1,10.54 14.99,10.54 I2C.2
SCRX  (via drill 0.51)
  Top 0.254: U$1.46 30.99,14.86 31.37,15.24 31.37,16.89 v31.5,17.02
  Bottom 0.254: v31.5,17.02 31.5,29.21 31.37,29.34 31.37,32 30.99,32.38 30.11,32.38 JP3.4
SCTX  (via drill 0.51)
  Top 0.254: U$1.47 v30.49,15.61 v30.48,15.62
  Bottom 0.254: v30.48,15.62 30.48,27.69 28.83,29.34 28.83,33.02 29.46,33.66 32.38,33.66 32.64,33.4 JP3.6
SDA  (via drill 0.51)
  Top 0.254: v26.42,16.13 26.29,16.13 25.97,16.45 | U$1.16 31.49,3.8 30.99,3.3 v30.23,3.3 | ACCELEROMETER.13 25.5,15.97 25.97,16.45 | 25.97,16.45 25.97,16.46 26.35,16.84 R12.1 26.29,17.95 26.59,17.95 27.43,18.8 27.43,20.21 U3.8 | IC1.10 11.66,18.27 v11.18,17.78
  Bottom 0.254: 17.65,11.56 I2C.1 17.65,9.27 15.24,6.86 15.24,1.91 16.13,1.02 25.65,1.02 27.94,3.3 v30.23,3.3 | 17.65,11.56 17.65,12.32 18.41,13.08 20.57,13.08 20.7,13.21 20.7,16.13 21.21,16.64 25.91,16.64 v26.42,16.13 | 17.65,11.56 17.02,12.19 13.46,12.19 11.3,14.35 11.3,17.27 11.18,17.4 v11.18,17.78
TXB  (via drill 0.51)
  Top 0.254: 18.32,19.27 IC1.23 19.39,19.27 v19.68,19.56 | v17.98,14.61 U$4.13
  Bottom 0.254: v19.68,19.56 19.18,19.56 18.54,18.92 18.54,14.86 v17.98,14.61
VBATT  (via drill 0.51)
  Top 0.254: 12.86,31.34 R6.2 | 16.94,34.04 L1.P$2 | R3.2 23.39,27.27 C3.1 23.48,27.18 v25.15,27.18 26.54,27.18 | U4.3 30.21,23.15 30.4,23.34 | U4.1 32.12,23.06 | 32.12,23.06 31.84,23.34 30.4,23.34 | 32.12,23.06 32.35,22.83 C15.1 C4.1 | 30.4,23.34 29.73,24.02 29.11,24.02 29.08,24.04 29.08,24.28 27.9,25.46 27.88,25.46 27.62,25.72 26.95,25.72 R10.2 26.92,25.9 26.92,26.92 26.67,27.18 26.54,27.18 | R6.2 13.27,31.2 R4.2 14.23,33.15 14.73,33.66 16.6,33.66 L1.P$2 | S2.3 11.65,31.41 12.32,30.73 13.09,30.73 R6.2 | L1.P$2 16.42,33.62 v15.62,34.42 | R5.2 25.93,27.79 26.54,27.18
  Bottom 0.254: v15.62,34.42 23.5,34.42 25.02,32.89 25.02,27.3 v25.15,27.18
VBUS
  Top 0.254: RECHARGE.1 5.02,20.7 C1.1 6.18,23.58 6.6,24 7.62,24 8.13,24.51 8.13,26.86 U1.4
VIBE_PWM
  Top 0.254: U$3.+ 37.82,13.86 U$1.37 U$1.38
VIN
  Top 0.254: R4.1 16.99,32.16 17.14,32 19.56,32 19.94,32.38 20.45,32.38 21.21,33.15 22.66,33.15 U2.5
XTALIN
  Top 0.254: C13.2 22.77,2.99 Y1.3 24.77,4.99 24.77,9.4 25.38,10.01 U$1.6
XTALINB
  Top 0.254: C17.2 19.26,25.28 Y2.3 17.22,25.27 16.26,25.27 16.13,25.15 16.13,21.84 15.38,21.09 IC1.2
XTALOUT
  Top 0.254: U$1.7 28.63,9.53 25.65,9.53 25.25,9.02 25.25,7.37 26.63,5.88 Y1.1 26.91,5.18 C12.2
XTALOUTB
  Top 0.254: C16.2 13.47,23.28 Y2.1 13.92,23.37 15.37,23.37 15.49,23.24 15.49,21.84 14.88,21.23 IC1.3

### Text on the board
tNames: Smart Watch Board V2 | 373 W13 | Jonathan Meed | David Jackson | Filippos Theodorakis | Tony Lucches